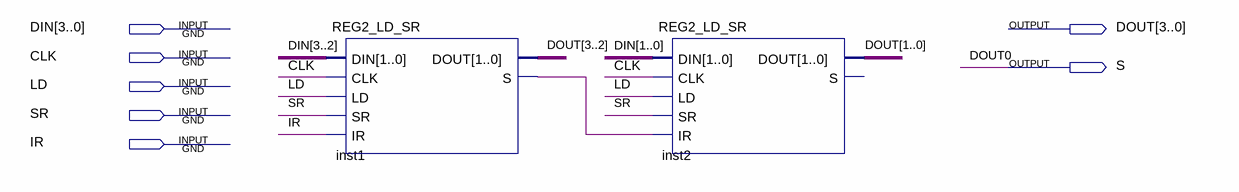
[diagram p0: schematic sheet]
// Quartus schematic REG4_LD_SR.bdf as structural Verilog: 2 symbols, 7 pins
module REG4_LD_SR (
  input  [3:0] DIN,
  input  CLK,
  input  LD,
  input  SR,
  input  IR,
  output [3:0] DOUT,
  output S
);

  wire inst1_s;

  REG2_LD_SR inst1 (.DIN(DIN[3:2]), .CLK(CLK), .LD(LD), .SR(SR), .IR(IR), .DOUT(DOUT[3:2]), .S(inst1_s));
  REG2_LD_SR inst2 (.DIN(DIN[1:0]), .CLK(CLK), .LD(LD), .SR(SR), .IR(inst1_s), .DOUT(DOUT[1:0]));  // open: S

  assign S = DOUT[0];
endmodule
